# EasyEDA schematic Generator.json
TITLE: Generator; REV: 1.0; Date: 2019-12-01; Sheet: 1/1; Drawn By: Stefan Burkhardt; Company: Private
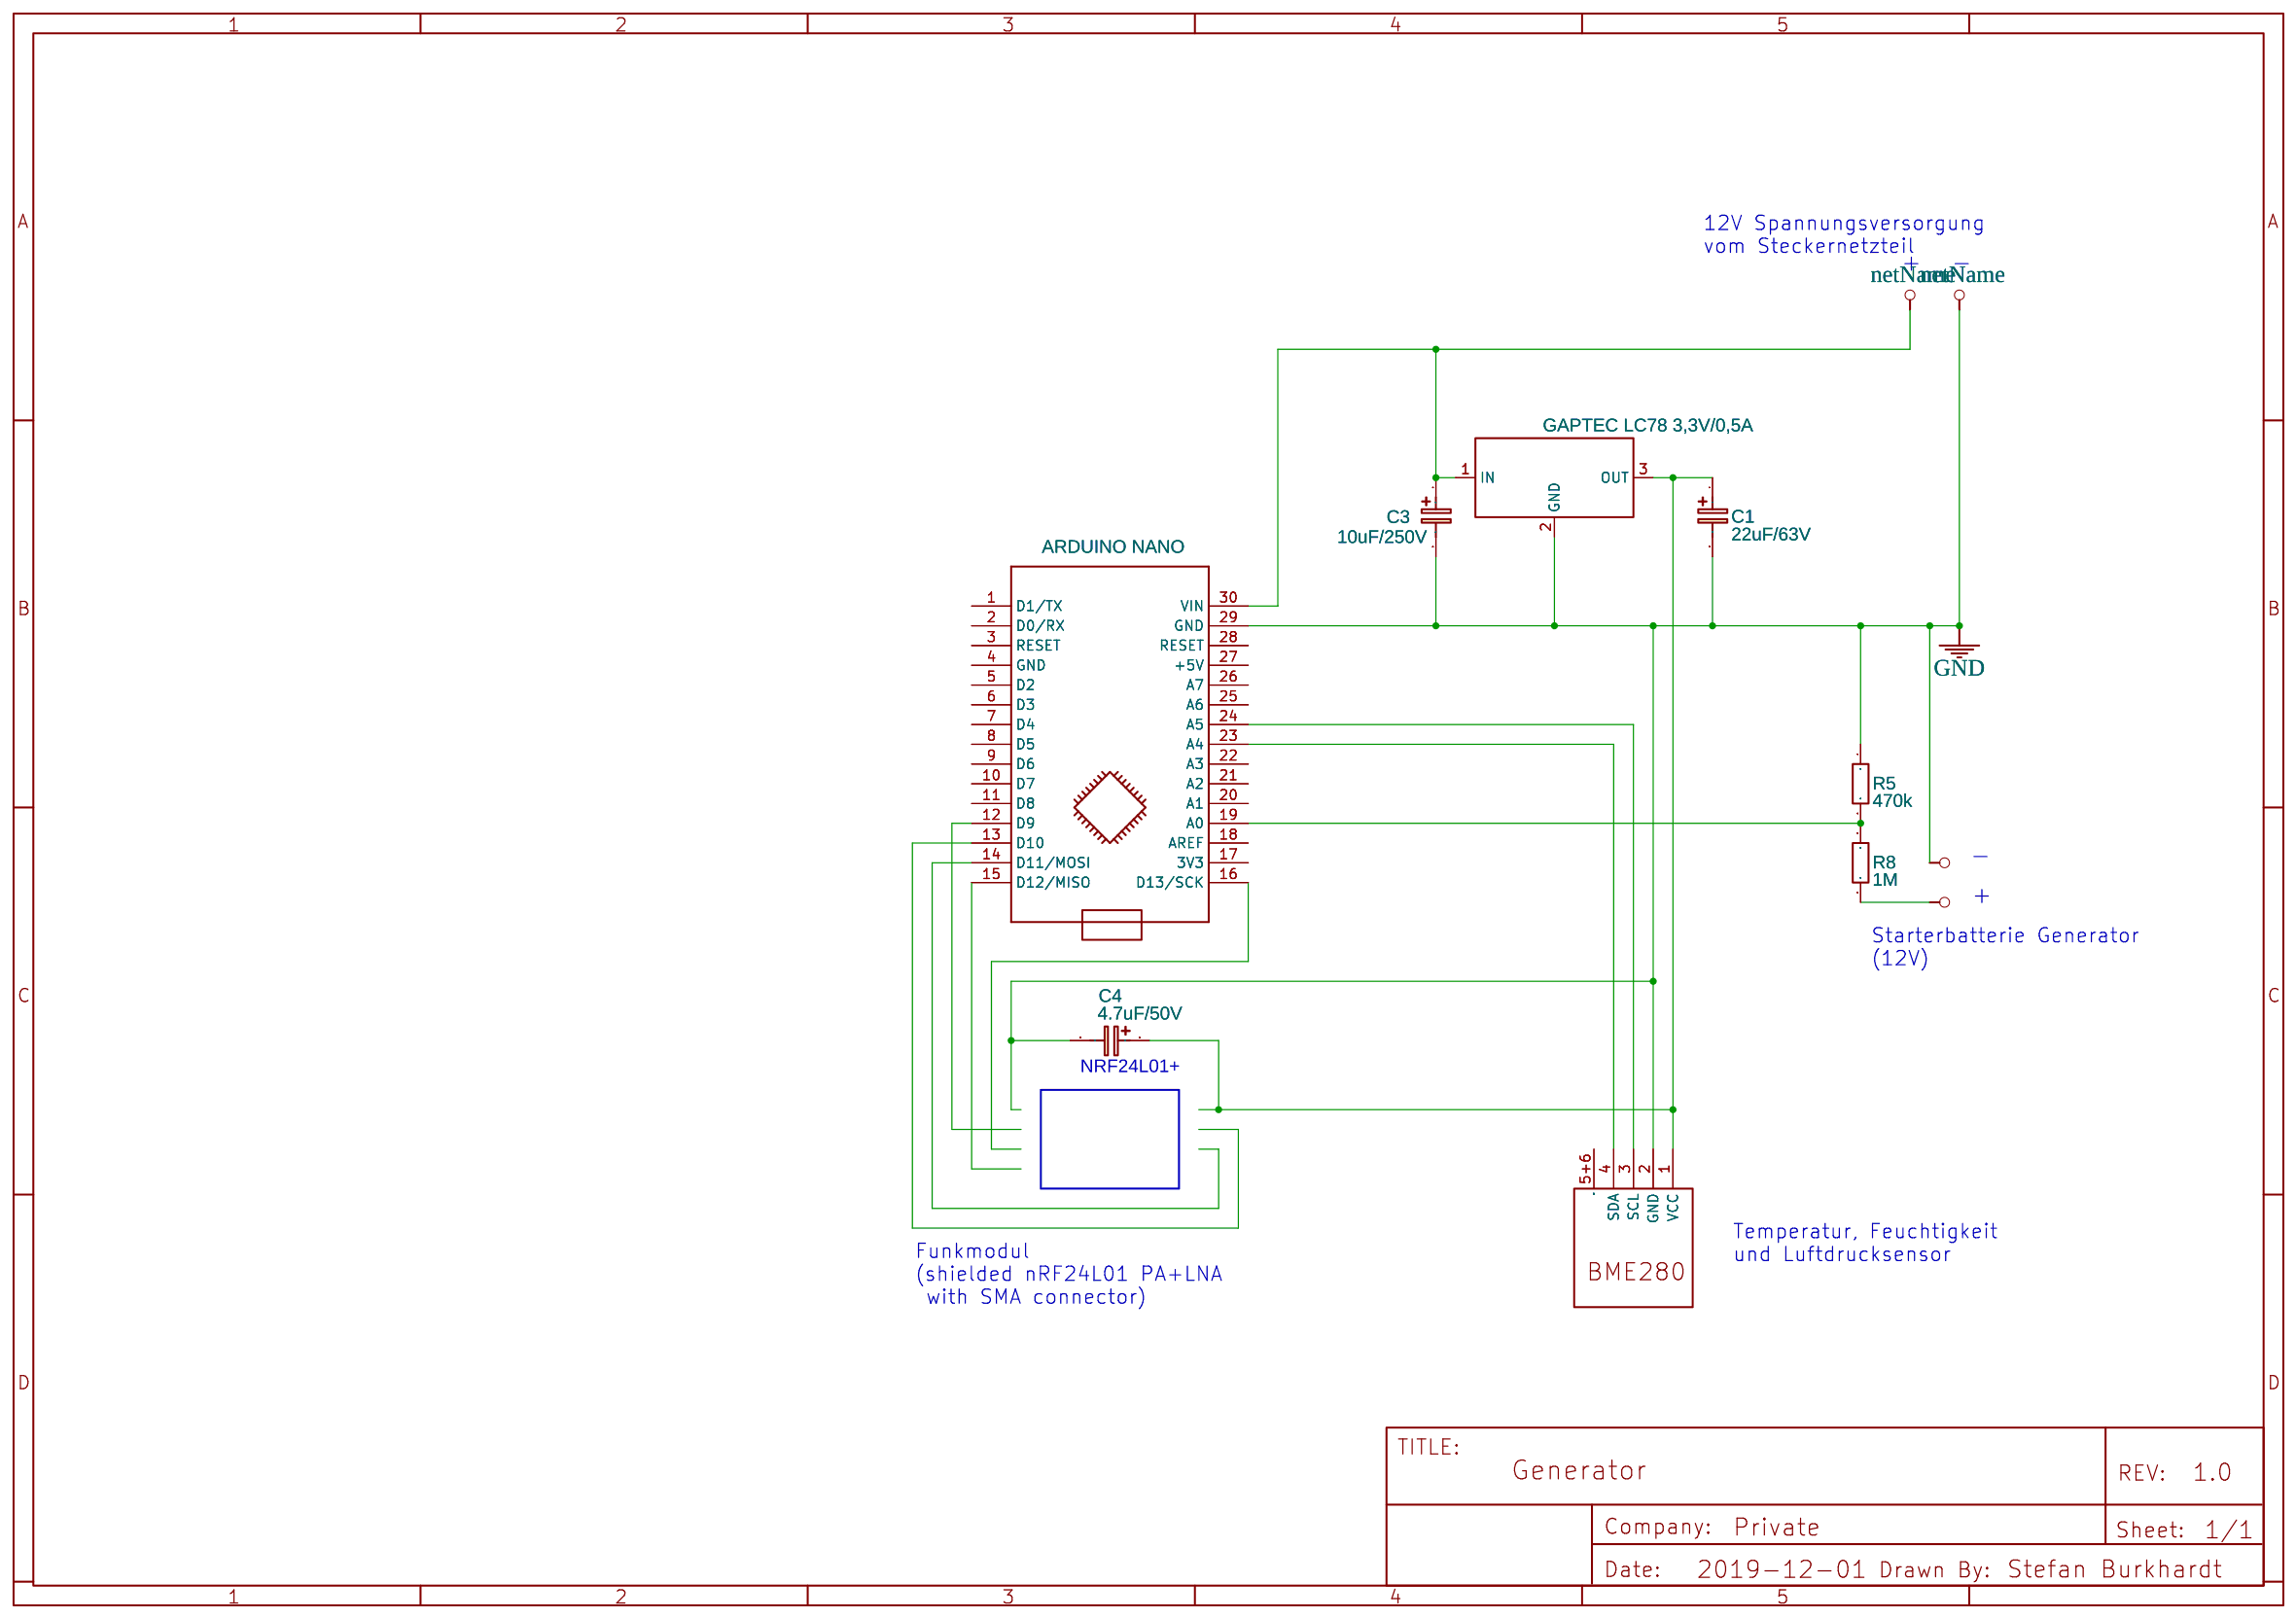
[diagram p0: schematic sheet]

## Parts
#1  -
C1  22uF/63V  [CAP-D3.0XF1.5]
C3  10uF/250V  [CAP-D3.0XF1.5]
C4  4.7uF/50V  [CAP-D3.0XF1.5]
R5  470k  [AXIAL-0.3]
R8  1M  [AXIAL-0.3]
U3  ARDUINO NANO  [ARDUINO_NANO]
U4  GAPTEC LC78 3,3V/0,5A  [GAPTEC_LC78]
U5  Adafruit Si7021  [HDR-5X1-2.54]

## Library data of the parts
#1 = -: BOM_Manufacturer Part: ?
C1 C3 C4 = Cap_Electrolytic(TH)_D3.0XF1.5_EU: Contributor: EasyEDA; Manufacturer Part: ?
R5 R8 = Res_AXIAL-0.3(1/8W)_EU: Manufacturer Part: ?
U3 = -: sourceId: KGSeAWhDB; Manufacturer Part: ?
U4 = -: Manufacturer Part: ?; Contributor: kbasten
U5 = -: Contributor: LucAce; Supplier Part: 3251; Supplier: Adafruit; Manufacturer Part: ?

## Nets
GND: C1.2 C3.1 C3.2 C4.2 R5.1 R8.2 U3.29(GND) U3.30(VIN) U4.1(IN) U4.2(GND) U5.2(GND)
Net-(C1-1): C1.1 C4.1 U4.3(OUT) U5.1(VCC)
Net-(R5-2): R5.2 R8.1 U3.19(A0)
Net-(U3-23): U3.23(A4) U5.4(SDA)
Net-(U3-24): U3.24(A5) U5.3(SCL)

Not connected (* = marked no-connect by the designer): U3 1(D1/TX) 2(D0/RX) 3(RESET) 4(GND) 5(D2) 6(D3) 7(D4) 8(D5) 9(D6) 10(D7) 11(D8) 12(D9) 13(D10) 14(D11/MOSI) 15(D12/MISO) 16(D13/SCK) 17(3V3) 18(AREF) 20(A1) 21(A2) 22(A3) 25(A6) 26(A7) 27(+5V) 28(RESET); U5 5+6(SDA)

## Notes on the sheet
- 12V Spannungsversorgung
  vom Steckernetzteil
- +
- -
- -
- +
- Starterbatterie Generator
  (12V)
- NRF24L01+
- Temperatur, Feuchtigkeit
  und Luftdrucksensor
- Funkmodul
  (shielded nRF24L01 PA+LNA
   with SMA connector)
